# Altium schematic sheet SH4 - USB.SchDoc: Jetson AGX Xavier Carrier Board - USB
size B; Engineer: Cindy Li, Chealsie Bains; Organization: UW Robotics; Address1: 200 University Avenue; Address2: Waterloo; Address3: Ontario; Address4: Canada N2L 3G6; DocumentNumber: 4; Revision: 1; SheetNumber: 4; SheetTotal: 12
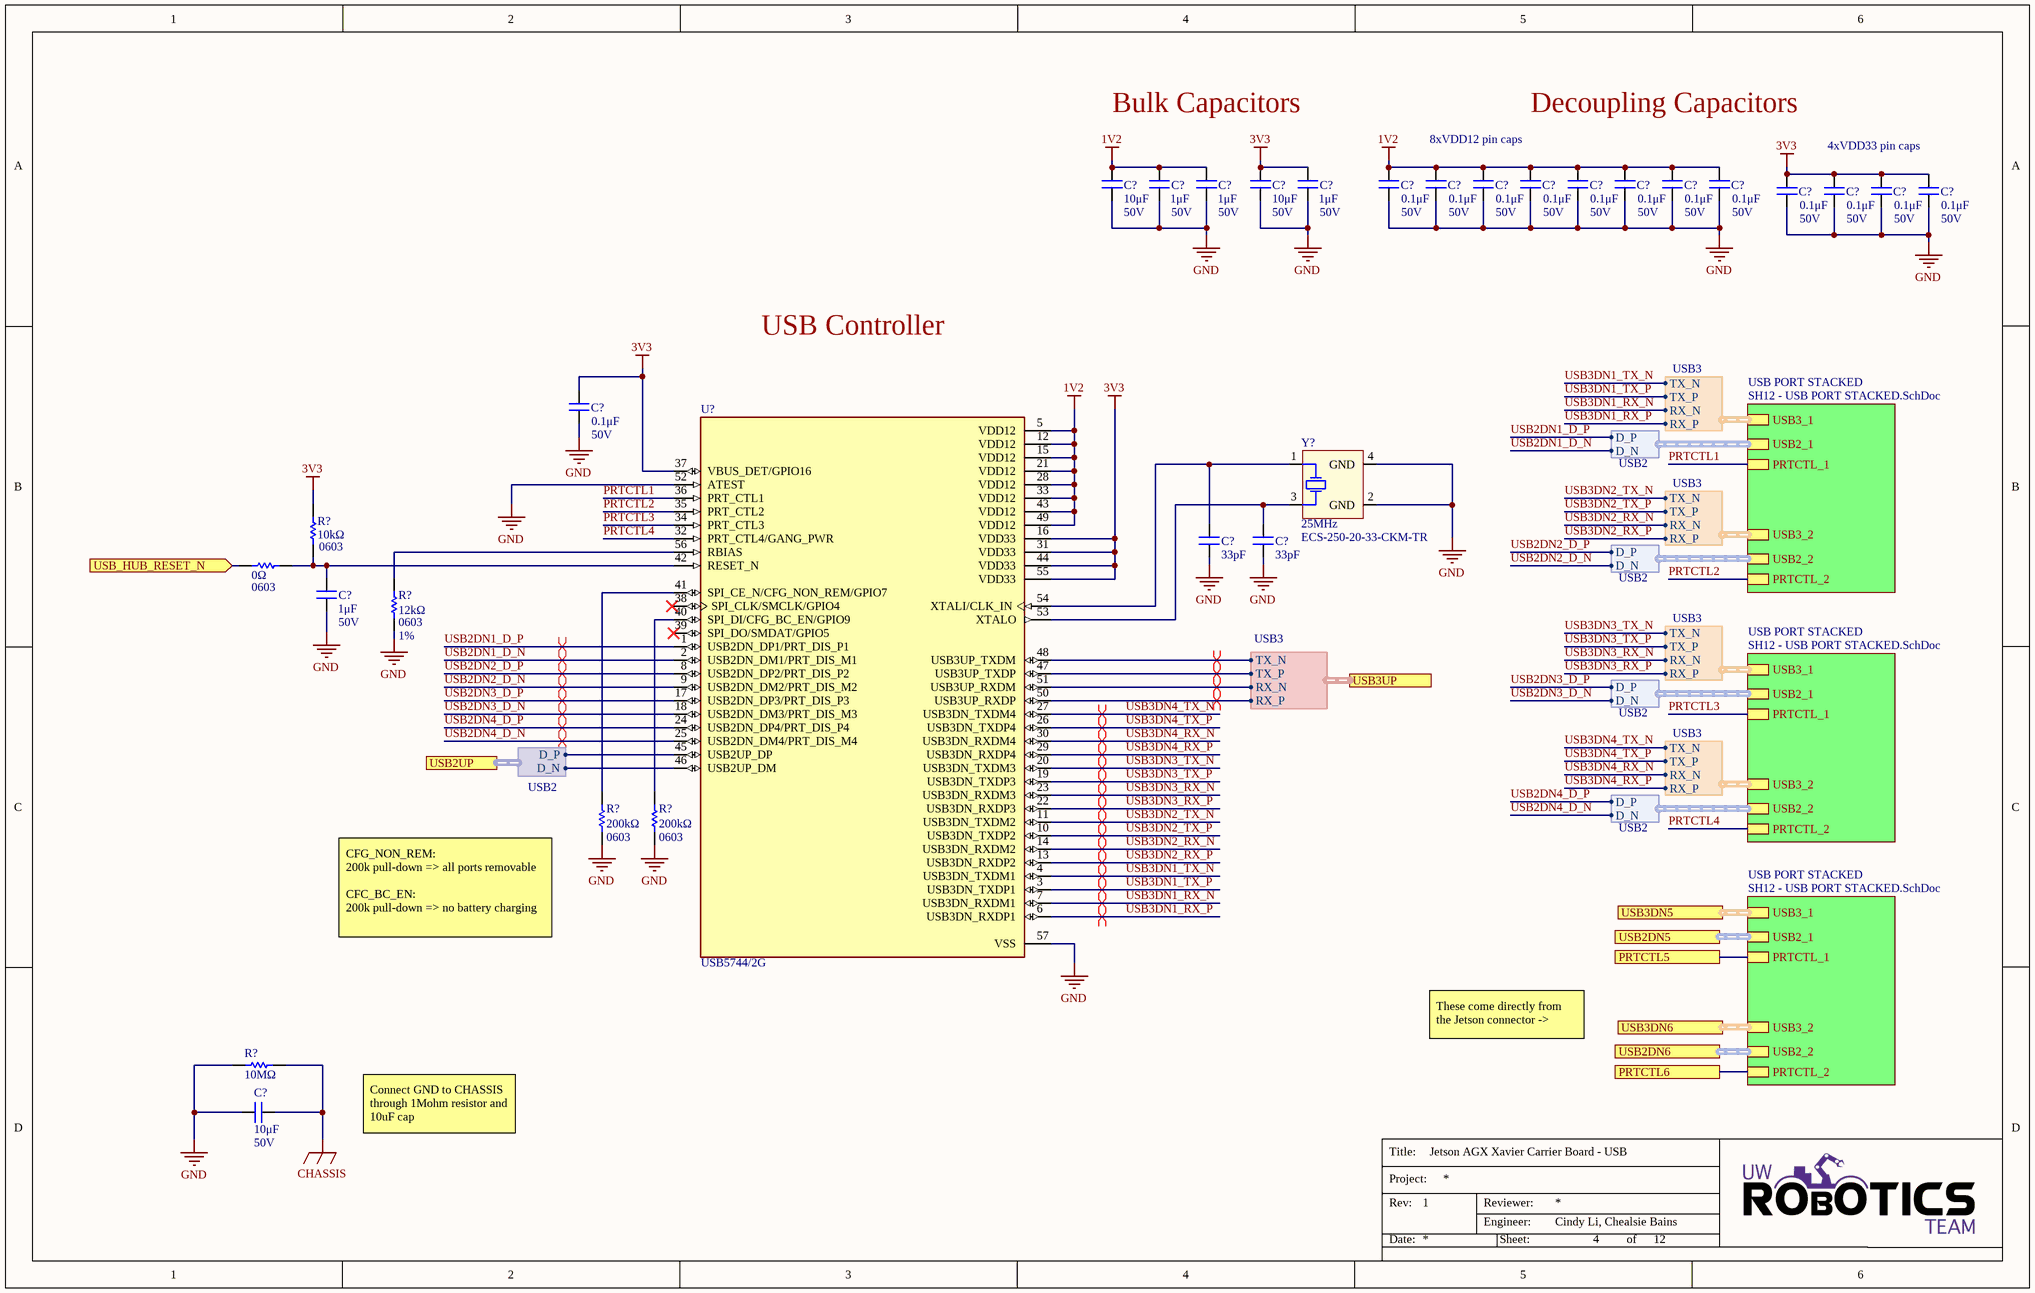
[diagram p0: SH4 - USB.SchDoc]

## Parts
(Parts that share a designator on the sheet are numbered #1, #2 ... from top to bottom, then left to right.)
C?#1  value 10μF  Voltage Rating: 50V  [CAP1206]  (hidden comment: CAP_10uF_50V_1206)
C?#2  value 1μF  Voltage Rating: 50V  [CAP0603]  (hidden comment: CAP_1uF_50V_0603)
C?#3  value 1μF  Voltage Rating: 50V  [CAP0603]  (hidden comment: CAP_1uF_50V_0603)
C?#4  value 10μF  Voltage Rating: 50V  [CAP1206]  (hidden comment: CAP_10uF_50V_1206)
C?#5  value 1μF  Voltage Rating: 50V  [CAP0603]  (hidden comment: CAP_1uF_50V_0603)
C?#6  value 0.1μF  Voltage Rating: 50V  [CAP0603]  (hidden comment: CAP_0.1uF_50V_0603)
C?#7  value 0.1μF  Voltage Rating: 50V  [CAP0603]  (hidden comment: CAP_0.1uF_50V_0603)
C?#8  value 0.1μF  Voltage Rating: 50V  [CAP0603]  (hidden comment: CAP_0.1uF_50V_0603)
C?#9  value 0.1μF  Voltage Rating: 50V  [CAP0603]  (hidden comment: CAP_0.1uF_50V_0603)
C?#10  value 0.1μF  Voltage Rating: 50V  [CAP0603]  (hidden comment: CAP_0.1uF_50V_0603)
C?#11  value 0.1μF  Voltage Rating: 50V  [CAP0603]  (hidden comment: CAP_0.1uF_50V_0603)
C?#12  value 0.1μF  Voltage Rating: 50V  [CAP0603]  (hidden comment: CAP_0.1uF_50V_0603)
C?#13  value 0.1μF  Voltage Rating: 50V  [CAP0603]  (hidden comment: CAP_0.1uF_50V_0603)
C?#14  value 0.1μF  Voltage Rating: 50V  [CAP0603]  (hidden comment: CAP_0.1uF_50V_0603)
C?#15  value 0.1μF  Voltage Rating: 50V  [CAP0603]  (hidden comment: CAP_0.1uF_50V_0603)
C?#16  value 0.1μF  Voltage Rating: 50V  [CAP0603]  (hidden comment: CAP_0.1uF_50V_0603)
C?#17  value 0.1μF  Voltage Rating: 50V  [CAP0603]  (hidden comment: CAP_0.1uF_50V_0603)
C?#18  value 0.1μF  Voltage Rating: 50V  [CAP0603]  (hidden comment: CAP_0.1uF_50V_0603)
C?#19  value 33pF  [CAP0603]  (hidden comment: CAP_33pF_50V_0603)
C?#20  value 33pF  [CAP0603]  (hidden comment: CAP_33pF_50V_0603)
C?#21  value 1μF  Voltage Rating: 50V  [CAP0603]  (hidden comment: CAP_1uF_50V_0603)
C?#22  value 10μF  Voltage Rating: 50V  [CAP1206]  (hidden comment: CAP_10uF_50V_1206)
R?#1  value 10kΩ  Package/Footprint: 0603  [RESC0603]  (hidden comment: RES_10kΩ_0603_5%)
R?#2  value 0Ω  Package/Footprint: 0603  [RESC0603]  (hidden comment: RES_0Ω_0603)
R?#3  value 12kΩ  Tolerance: 1%  Package: 0603  [RESC0603]  (hidden comment: RES_12kΩ_0603)
R?#4  value 200kΩ  Package/Footprint: 0603  [RESC0603]  (hidden comment: RES_200kΩ_0603_5%)
R?#5  value 200kΩ  Package/Footprint: 0603  [RESC0603]  (hidden comment: RES_200kΩ_0603_5%)
R?#6  value 10MΩ  [RESC0805]  (hidden comment: RES_10MΩ_0805)
U?  USB5744/2G  [QFN40P700X700X100-57N]
Y?  Frequency: 25MHz  Manufacturer Part Number 1: ECS-250-20-33-CKM-TR  [XTAL_ECS-250-20-33-CKM-TR]  (hidden comment: CRYSTAL_25MHZ_20PF)

## Sub-sheets
USB PORT STACKED = SH12 - USB PORT STACKED.SchDoc: USB3_1 (harness USB3), PRTCTL_1, USB2_1 (harness USB2), USB3_2 (harness USB3), USB2_2 (harness USB2), PRTCTL_2
USB PORT STACKED = SH12 - USB PORT STACKED.SchDoc: USB3_1 (harness USB3), PRTCTL_1, USB2_1 (harness USB2), USB3_2 (harness USB3), USB2_2 (harness USB2), PRTCTL_2
USB PORT STACKED = SH12 - USB PORT STACKED.SchDoc: USB3_1 (harness USB3), PRTCTL_1, USB2_1 (harness USB2), USB3_2 (harness USB3), USB2_2 (harness USB2), PRTCTL_2

## Ports
PRTCTL5, PRTCTL6, USB2DN5, USB2DN6, USB2UP (harness USB2), USB3DN5, USB3DN6, USB3UP (harness USB3), USB_HUB_RESET_N (in)

## Harnesses
USB3: TX_N, TX_P, RX_N, RX_P
USB2: D_P, D_N
USB3: RX_N, RX_P, TX_P, TX_N

## Nets
1V2: C?#1.2 C?#2.2 C?#3.2 C?#6.2 C?#7.2 C?#8.2 C?#9.2 C?#10.2 C?#11.2 C?#12.2 C?#13.2 U?.5(VDD12) U?.12(VDD12) U?.15(VDD12) U?.21(VDD12) U?.28(VDD12) U?.33(VDD12) U?.43(VDD12) U?.49(VDD12)
3V3: C?#4.2 C?#5.2 C?#14.2 C?#15.2 C?#16.2 C?#17.2 C?#18.2 R?#1.2 U?.16(VDD33) U?.31(VDD33) U?.37(VBUS_DET/GPIO16) U?.44(VDD33) U?.55(VDD33)
CHASSIS: C?#22.1 R?#6.2
GND: C?#1.1 C?#2.1 C?#3.1 C?#4.1 C?#5.1 C?#6.1 C?#7.1 C?#8.1 C?#9.1 C?#10.1 C?#11.1 C?#12.1 C?#13.1 C?#14.1 C?#15.1 C?#16.1 C?#17.1 C?#18.1 C?#19.1 C?#20.1 C?#21.1 C?#22.2 R?#3.1 R?#4.1 R?#5.1 R?#6.1 U?.52(ATEST) U?.57(VSS) Y?.2(GND) Y?.4(GND)
PRTCTL1: U?.36(PRT_CTL1) ; sheet USB PORT STACKED/PRTCTL_1
PRTCTL2: U?.35(PRT_CTL2) ; sheet USB PORT STACKED/PRTCTL_2
PRTCTL3: U?.34(PRT_CTL3) ; sheet USB PORT STACKED/PRTCTL_1
PRTCTL4: U?.32(PRT_CTL4/GANG_PWR) ; sheet USB PORT STACKED/PRTCTL_2
PRTCTL5: port PRTCTL5, sheet USB PORT STACKED/PRTCTL_1
PRTCTL6: port PRTCTL6, sheet USB PORT STACKED/PRTCTL_2
USB2DN1_D_N: U?.2(USB2DN_DM1/PRT_DIS_M1) ; sheet USB PORT STACKED/USB2_1.D_N
USB2DN1_D_P: U?.1(USB2DN_DP1/PRT_DIS_P1) ; sheet USB PORT STACKED/USB2_1.D_P
USB2DN2_D_N: U?.9(USB2DN_DM2/PRT_DIS_M2) ; sheet USB PORT STACKED/USB2_2.D_N
USB2DN2_D_P: U?.8(USB2DN_DP2/PRT_DIS_P2) ; sheet USB PORT STACKED/USB2_2.D_P
USB2DN3_D_N: U?.18(USB2DN_DM3/PRT_DIS_M3) ; sheet USB PORT STACKED/USB2_1.D_N
USB2DN3_D_P: U?.17(USB2DN_DP3/PRT_DIS_P3) ; sheet USB PORT STACKED/USB2_1.D_P
USB2DN4_D_N: U?.25(USB2DN_DM4/PRT_DIS_M4) ; sheet USB PORT STACKED/USB2_2.D_N
USB2DN4_D_P: U?.24(USB2DN_DP4/PRT_DIS_P4) ; sheet USB PORT STACKED/USB2_2.D_P
USB3DN1_RX_N: U?.7(USB3DN_RXDM1) ; sheet USB PORT STACKED/USB3_1.RX_N
USB3DN1_RX_P: U?.6(USB3DN_RXDP1) ; sheet USB PORT STACKED/USB3_1.RX_P
USB3DN1_TX_N: U?.4(USB3DN_TXDM1) ; sheet USB PORT STACKED/USB3_1.TX_N
USB3DN1_TX_P: U?.3(USB3DN_TXDP1) ; sheet USB PORT STACKED/USB3_1.TX_P
USB3DN2_RX_N: U?.14(USB3DN_RXDM2) ; sheet USB PORT STACKED/USB3_2.RX_N
USB3DN2_RX_P: U?.13(USB3DN_RXDP2) ; sheet USB PORT STACKED/USB3_2.RX_P
USB3DN2_TX_N: U?.11(USB3DN_TXDM2) ; sheet USB PORT STACKED/USB3_2.TX_N
USB3DN2_TX_P: U?.10(USB3DN_TXDP2) ; sheet USB PORT STACKED/USB3_2.TX_P
USB3DN3_RX_N: U?.23(USB3DN_RXDM3) ; sheet USB PORT STACKED/USB3_1.RX_N
USB3DN3_RX_P: U?.22(USB3DN_RXDP3) ; sheet USB PORT STACKED/USB3_1.RX_P
USB3DN3_TX_N: U?.20(USB3DN_TXDM3) ; sheet USB PORT STACKED/USB3_1.TX_N
USB3DN3_TX_P: U?.19(USB3DN_TXDP3) ; sheet USB PORT STACKED/USB3_1.TX_P
USB3DN4_RX_N: U?.30(USB3DN_RXDM4) ; sheet USB PORT STACKED/USB3_2.RX_N
USB3DN4_RX_P: U?.29(USB3DN_RXDP4) ; sheet USB PORT STACKED/USB3_2.RX_P
USB3DN4_TX_N: U?.27(USB3DN_TXDM4) ; sheet USB PORT STACKED/USB3_2.TX_N
USB3DN4_TX_P: U?.26(USB3DN_TXDP4) ; sheet USB PORT STACKED/USB3_2.TX_P
USB_HUB_RESET_N: R?#2.1 ; port USB_HUB_RESET_N
NetC?#19_2: C?#19.2 U?.54(XTALI/CLK_IN) Y?.1(HOT)
NetC?#20_2: C?#20.2 U?.53(XTALO) Y?.3(HOT)
NetC?#21_2: C?#21.2 R?#1.1 R?#2.2 U?.42(RESET_N)
NetR?#3_2: R?#3.2 U?.56(RBIAS)
NetR?#4_2: R?#4.2 U?.41(SPI_CE_N/CFG_NON_REM/GPIO7)
NetR?#5_2: R?#5.2 U?.40(SPI_DI/CFG_BC_EN/GPIO9)
NetU?_45: U?.45(USB2UP_DP) ; port USB2UP.D_P
NetU?_46: U?.46(USB2UP_DM) ; port USB2UP.D_N
NetU?_47: U?.47(USB3UP_TXDP) ; port USB3UP.TX_P
NetU?_48: U?.48(USB3UP_TXDM) ; port USB3UP.TX_N
NetU?_50: U?.50(USB3UP_RXDP) ; port USB3UP.RX_P
NetU?_51: U?.51(USB3UP_RXDM) ; port USB3UP.RX_N

Not connected (* = marked no-connect by the designer): U? 38(SPI_CLK/SMCLK/GPIO4) 39(SPI_DO/SMDAT/GPIO5)*

## Buses and harness runs
harness port USB2DN5 = sheet USB PORT STACKED/USB2_1
harness port USB2DN6 = sheet USB PORT STACKED/USB2_2
harness port USB3DN5 = sheet USB PORT STACKED/USB3_1
harness port USB3DN6 = sheet USB PORT STACKED/USB3_2

## Layout directives
differential pair: NetU?_47, NetU?_48, NetU?_50, NetU?_51, USB2DN1_D_N, USB2DN1_D_P, USB2DN2_D_N, USB2DN2_D_P, USB2DN3_D_N, USB2DN3_D_P, USB2DN4_D_N, USB2DN4_D_P, USB3DN1_RX_N, USB3DN1_RX_P, USB3DN1_TX_N, USB3DN1_TX_P, USB3DN2_RX_N, USB3DN2_RX_P, USB3DN2_TX_N, USB3DN2_TX_P, USB3DN3_RX_N, USB3DN3_RX_P, USB3DN3_TX_N, USB3DN3_TX_P, USB3DN4_RX_N, USB3DN4_RX_P, USB3DN4_TX_N, USB3DN4_TX_P

## Notes on the sheet
- Bulk Capacitors
- (near C?#7) 8xVDD12 pin caps
- Decoupling Capacitors
- (near C?#15) 4xVDD33 pin caps
- USB Controller
- (near R?#4) CFG_NON_REM:
  200k pull-down => all ports removable
  CFC_BC_EN:
  200k pull-down => no battery charging
- These come directly from the Jetson connector ->
- Connect GND to CHASSIS through 1Mohm resistor and 10uF cap
- Title:
- Project:
- Date:
- Rev:
- Reviewer:
- Engineer:
- Sheet:
- of

## Library data of the parts
C?#1 C?#4 C?#22 = CAP_10uF_50V_1206: CAP CER 10UF 50V X5R 1206; Manufacturer 1: Murata; Manufacturer Part Number 1: GRT31CR61H106KE01L; Package/Footprint: 1206; Supplier Part Number 1: 490-12456-1-ND; Supplier 1: Digi-Key; Mounting Type: SMD; Dielectric: X5R
C?#2 C?#3 C?#5 C?#21 = CAP_1uF_50V_0603: CAP CER 1UF 50V X6S 0603; Manufacturer Part Number 1: C1608X6S1H105K080AC; Manufacturer 1: TDK Corporation; Supplier Part Number 1: 445-7424-1-ND; Supplier 1: Digi-Key; Dielectric: X6S
C?#6-C?#18 = CAP_0.1uF_50V_0603: CAP CER 0.1UF 50V X7R 0603; Manufacturer Part Number 1: CC0603KRX7R9BB104; Manufacturer 1: Yageo; Package/Footprint: 0603; Supplier Part Number 1: 311-1344-1-ND; Supplier 1: Digi-Key; Mounting Type: SMD; Dielectric: X7R
C?#19 C?#20 = CAP_33pF_50V_0603: CAP CER 33PF 50V C0G/NP0; Manufacturer 1: Yageo; Manufacturer Part Number 1: CC0603JRNPO9BN330; Package/Footprint: 0603; Dielectric: C0G; Supplier 1: Digi-Key; Mounting Type: SMD; Voltage Rating: 50V; Supplier Part Number 1: 311-1064-1-ND
R?#1 = RES_10kΩ_0603_5%: RES 10K OHM 5% 1/10W 0603; Manufacturer 1: Yageo; Manufacturer Part Number 1: RC0603JR-0710KL; Supplier Part Number 1: 311-10KGRCT-ND; Supplier 1: Digi-Key; Mounting Type: SMD
R?#2 = RES_0Ω_0603: RES 0 OHM JUMPER 1/10W 0603; Manufacturer 1: Yageo; Manufacturer Part Number 1: RC0603JR-070RL; Supplier Part Number 1: 311-0.0GRCT-ND; Supplier 1: Digi-Key; Mounting Type: SMD
R?#3 = RES_12kΩ_0603_1%: RES 12K OHM 1% 1/10W 0603; Manufacturer 1: Vishay Dale; Manufacturer Part Number 1: CRCW060312K0FKEAC; Power: 0.1W; Supplier Part Number 1: 541-4046-1-ND; Supplier 1: Digi-Key
R?#4 R?#5 = RES_200kΩ_0603_5%: RES SMD 200K OHM 5% 1/10W 0603; Manufacturer 1: Panasonic Electronic Components; Manufacturer Part Number 1: ERJ-3GEYJ204V; Supplier Part Number 1: P200KGCT-ND; Supplier 1: Digi-Key; Mounting Type: SMD
R?#6 = RES_10MΩ_0805_5%: RES 10M OHM 5% 1/8W 0805; Manufacturer 1: Yageo; Manufacturer Part Number 1: RC0805JR-0710ML; Supplier Part Number 1: 311-10MARCT-ND; Supplier 1: Digi-Key
U? = USB5744/2G: USB Hub Controller USB 3.1 USB Interface 56-VQFN (7x7); Manufacturer 1: Microchip Technology; Standards: USB 3.1; Supply Voltage: 1.2V, 3.3V; Manufacturer Part Number 1: USB5744/2G; Supplier 1: Digi-Key; Supplier Part Number 1: USB5744/2G-ND; Package: 56-VQFN (7x7)
Y? = CRYSTAL_25MHZ_20PF: CRYSTAL 25.0000MHZ 20PF SMD; Manufacturer 1: ECS Inc.; Mounting Type: SMD; Package/Footprint: SMD; Load Capacitance: 20pF; Supplier 1: Digi-Key; Supplier Part Number 1: XC1817CT-ND